# Altium project PCB817.PrjPCB
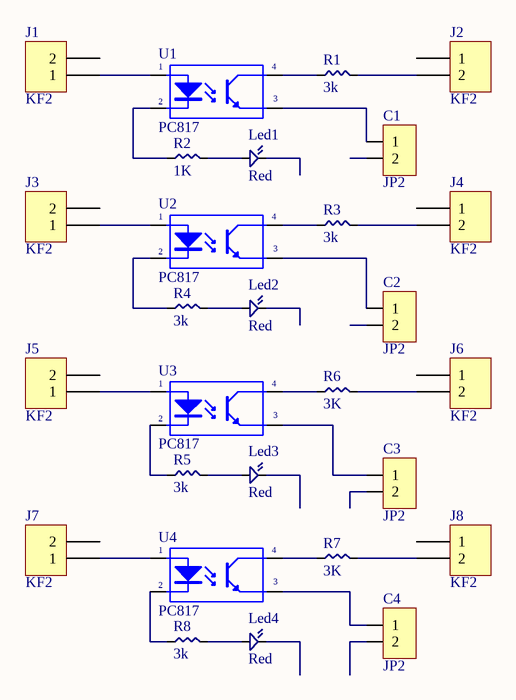
[diagram p0: Schematic.SchDoc]
1 sheet, 28 parts. Net scope: global (net labels, ports and power ports of the same name join across sheets).
Board file: PCB.PcbDoc

## Sheet Schematic.SchDoc
size A

### Parts
C1  JP2  [JP2-D1T]
C2  JP2  [JP2-D1T]
C3  JP2  [JP2-D1T]
C4  JP2  [JP2-D1T]
J1  KF2  [KF2-3.5]
J2  KF2  [KF2-3.5]
J3  KF2  [KF2-3.5]
J4  KF2  [KF2-3.5]
J5  KF2  [KF2-3.5]
J6  KF2  [KF2-3.5]
J7  KF2  [KF2-3.5]
J8  KF2  [KF2-3.5]
Led1  Red  [LED 0603 SMD]
Led2  Red  [LED 0603 SMD]
Led3  Red  [LED 0603 SMD]
Led4  Red  [LED 0603 SMD]
R1  3k  [SMD 0603 Res]
R2  1K  [SMD 0603 Res]
R3  3k  [SMD 0603 Res]
R4  3k  [SMD 0603 Res]
R5  3k  [SMD 0603 Res]
R6  3K  [SMD 0603 Res]
R7  3K  [SMD 0603 Res]
R8  3k  [SMD 0603 Res]
U1  PC817  [DIP4]
U2  PC817  [DIP4]
U3  PC817  [DIP4]
U4  PC817  [DIP4]

### Nets
NetC1_1: C1.1 U1.3(E)
NetC2_1: C2.1 U2.3(E)
NetC3_1: C3.1 U3.3(E)
NetC4_1: C4.1 U4.3(E)
NetJ1_1: J1.1 U1.1(A)
NetJ2_2: J2.2 R1.2
NetJ3_1: J3.1 U2.1(A)
NetJ4_2: J4.2 R3.2
NetJ5_1: J5.1 U3.1(A)
NetJ6_2: J6.2 R6.2
NetJ7_1: J7.1 U4.1(A)
NetJ8_2: J8.2 R7.2
NetLed1_1: Led1.1 R2.2
NetLed2_1: Led2.1 R4.2
NetLed3_1: Led3.1 R5.2
NetLed4_1: Led4.1 R8.2
NetR1_1: R1.1 U1.4(C)
NetR2_1: R2.1 U1.2(K)
NetR3_1: R3.1 U2.4(C)
NetR4_1: R4.1 U2.2(K)
NetR5_1: R5.1 U3.2(K)
NetR6_1: R6.1 U3.4(C)
NetR7_1: R7.1 U4.4(C)
NetR8_1: R8.1 U4.2(K)

Not connected (* = marked no-connect by the designer): C1 2; C2 2; C3 2; C4 2; J1 2; J2 1; J3 2; J4 1; J5 2; J6 1; J7 2; J8 1; Led1 2; Led2 2; Led3 2; Led4 2

### Library data of the parts
C1-C4 = JP2: WR-PHD 2.54 mm Angled Socket Header; Manufacturer: W¨¹rth Elektronik eiSos GmbH; partNo: 613002143121; ComponentLink1 Description: Manufacturer; ComponentLink2 Description: Datasheet; NoPins: 02; Created Date: 29 March 2013; ComponentLink1URL: http://www.we-online.com; ComponentLink2URL: http://katalog.we-online.de/em/datasheet/6130xx143121.pdf; Created by: Karrer Zheng
J1-J8 = KF2: Manufacturer: Würth Elektronik eiSos GmbH; partNo: 691103110002; ComponentLink1 Description: Manufacturer; ComponentLink2 Description: Datasheet; NoPins: 2; Created Date: 29 October 2013; ComponentLink1URL: http://www.we-online.com; ComponentLink2URL: http://katalog.we-online.de/em/datasheet/6911031100xx.pdf; Created by: Karrer Zheng
Led1-Led4 = 0603 SMD LED
R1-R8 = 0603 Res
U1-U4 = PC817: Single Opto; Value: PC817